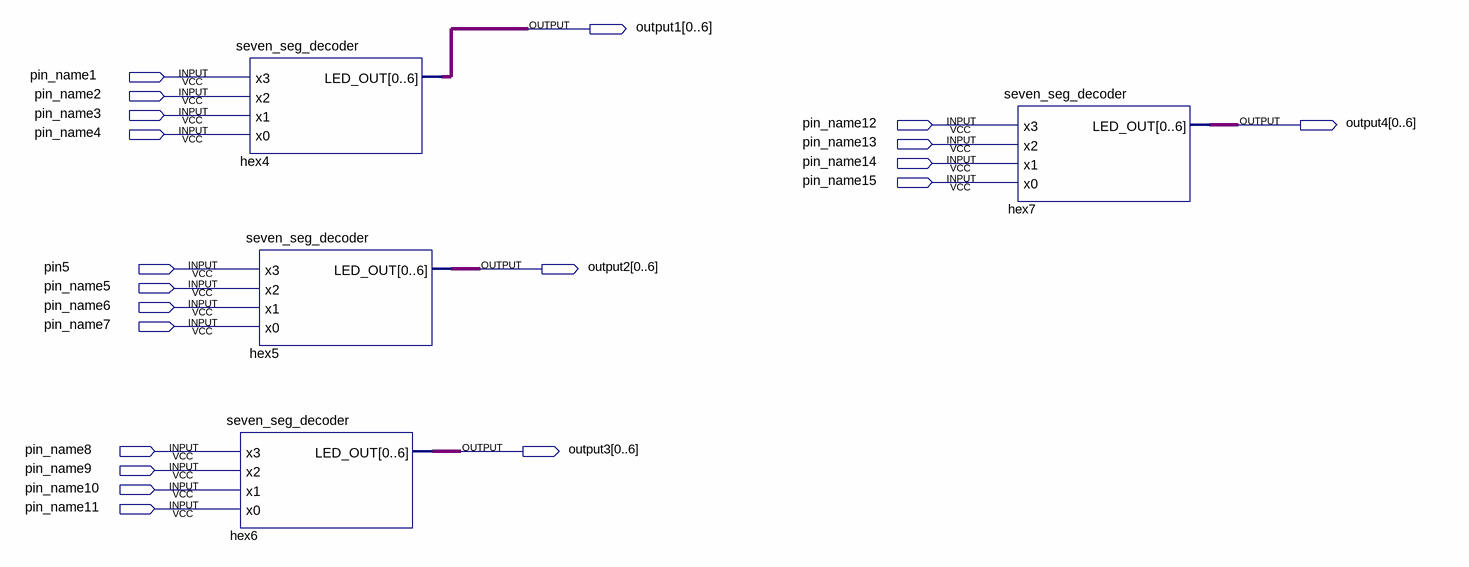
[diagram p0: schematic sheet]
// Quartus schematic lab5step1.bdf as structural Verilog: 4 symbols, 20 pins
module lab5step1 (
  input  pin_name1,
  input  pin_name2,
  input  pin_name3,
  input  pin_name12,
  input  pin_name4,
  input  pin_name13,
  input  pin_name14,
  input  pin_name15,
  input  pin5,
  input  pin_name5,
  input  pin_name6,
  input  pin_name7,
  input  pin_name8,
  input  pin_name9,
  input  pin_name10,
  input  pin_name11,
  output [0:6] output1,
  output [0:6] output4,
  output [0:6] output2,
  output [0:6] output3
);

  seven_seg_decoder hex4 (.x3(pin_name1), .x2(pin_name2), .x1(pin_name3), .x0(pin_name4), .LED_OUT(output1));
  seven_seg_decoder hex5 (.x3(pin5), .x2(pin_name5), .x1(pin_name6), .x0(pin_name7), .LED_OUT(output2));
  seven_seg_decoder hex6 (.x3(pin_name8), .x2(pin_name9), .x1(pin_name10), .x0(pin_name11), .LED_OUT(output3));
  seven_seg_decoder hex7 (.x3(pin_name12), .x2(pin_name13), .x1(pin_name14), .x0(pin_name15), .LED_OUT(output4));
endmodule
